# Altium schematic sheet GasSensor.SchDoc: BME688 Wiring
size A; SheetNumber: 2; SheetTotal: 5; SPICEModelCacheJFNWPNPT: <root> / <DocumentId>JFNWPNPT</DocumentId> / </root>
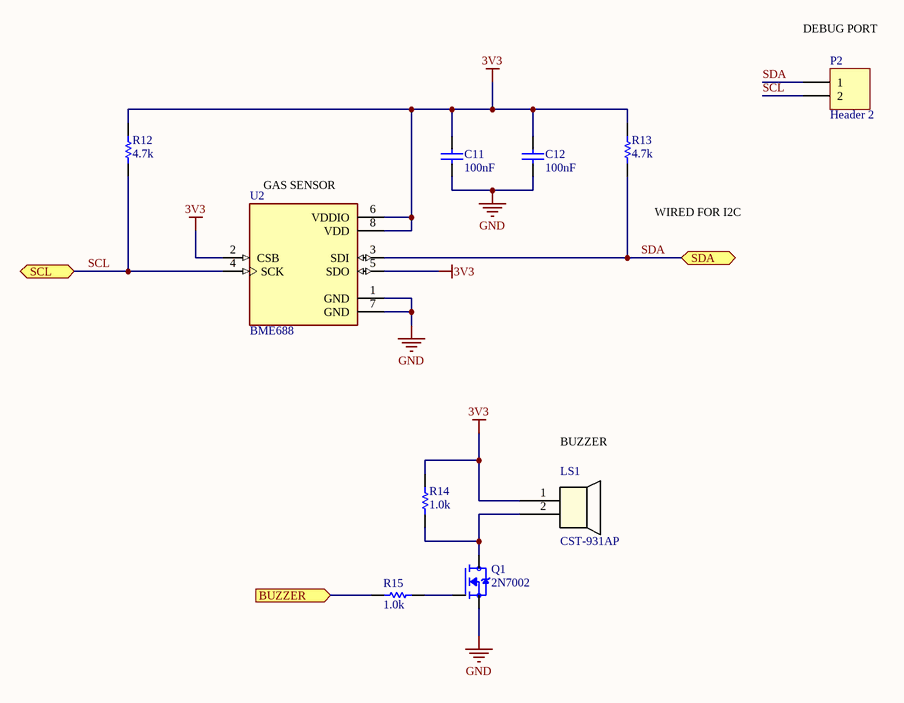
[diagram p0: GasSensor.SchDoc]

## Parts
C11  value 100nF  [0402cap]  (hidden comment: C0402)
C12  value 100nF  [0402cap]  (hidden comment: C0402)
LS1  CST-931AP  [CST-931AP_CUD]
P2  Header 2  [HDR1X2]
Q1  2N7002  [SOT95P240X111-3N]
R12  value 4.7k  [0402RES]  (hidden comment: R0402)
R13  value 4.7k  [0402RES]  (hidden comment: R0402)
R14  value 1.0k  [0805RES]  (hidden comment: R0805)
R15  value 1.0k  [0402RES]  (hidden comment: R0402)
U2  BME688  [IC_BME688]

## Ports
BUZZER (in), SCL (bidir), SDA (bidir)

## Nets
3V3: C11.2 C12.2 LS1.1 R12.2 R13.2 R14.2 U2.2(CSB) U2.5(SDO) U2.6(VDDIO) U2.8(VDD)
GND: C11.1 C12.1 Q1.2(S) U2.1(GND) U2.7(GND)
BUZZER: R15.2 ; port BUZZER
SCL: P2.2 R12.1 U2.4(SCK) ; port SCL
SDA: P2.1 R13.1 U2.3(SDI) ; port SDA
NetLS1_2: LS1.2 Q1.3(D) R14.1
NetQ1_1: Q1.1(G) R15.1

## Notes on the sheet
- (near P2) DEBUG PORT
- (near U2) GAS SENSOR
- (near R13) WIRED FOR I2C
- BUZZER

## Library data of the parts
C11 C12 = C0402: 0402 Ceramic Chip Capacitor - Standard
LS1 = CST-931AP: No Description Available; Mfr_Name: CUI Devices; RefDes: RefDes; Type: Type
P2 = Header 2: Header, 2-Pin; LatestRevisionDate: 17-Jul-2002; LatestRevisionNote: Re-released for DXP Platform.; Publisher: Altium Limited
Q1 = 2N7002: N-Channel 60V 280mA (Ta) 350mW (Ta) Surface Mount SOT-23-3 (TO-236); MP: altium_native_batch; Package: None; Price: None; Availability: Unavailable; Value: *
R12 R13 R15 = R0402: 0402 Chip Resistor - Standard; ComponentLink1URL: *
R14 = R0805: 0805 Chip Resistor - Standard
U2 = BME688: Gas sensor measuring relative humidity, barometric pressure, ambient temperature and gas (VOC); Package: None; MP: BME688; Price: None; Availability: Unavailable; Value: *